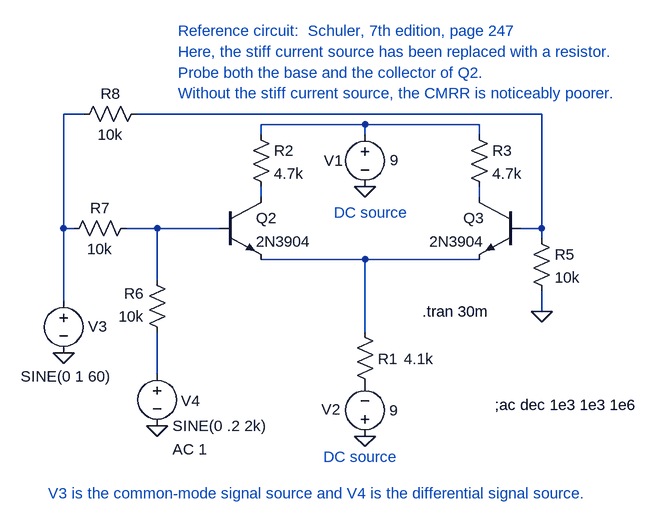
[diagram p0: schematic poordiffamp.asc]
poordiffamp.asc, the LTspice schematic file:
Version 4
SHEET 1 2236 680
WIRE -304 16 -336 16
WIRE 400 16 -224 16
WIRE 128 32 -32 32
WIRE 304 32 128 32
WIRE -32 48 -32 32
WIRE 128 48 128 32
WIRE 304 48 304 32
WIRE -32 144 -32 128
WIRE 304 144 304 128
WIRE -336 192 -336 16
WIRE -320 192 -336 192
WIRE -192 192 -240 192
WIRE -96 192 -192 192
WIRE 400 192 400 16
WIRE 400 192 368 192
WIRE 400 208 400 192
WIRE 128 240 -32 240
WIRE 304 240 128 240
WIRE -192 272 -192 192
WIRE -336 304 -336 192
WIRE 400 320 400 288
WIRE 128 352 128 240
WIRE -192 416 -192 352
FLAG 128 128 0
FLAG 128 512 0
FLAG -336 384 0
FLAG -192 496 0
FLAG 400 320 0
SYMBOL voltage 128 32 R0
WINDOW 0 -63 56 Left 0
WINDOW 3 38 55 Left 0
WINDOW 123 0 0 Left 0
WINDOW 39 24 132 Left 0
SYMATTR InstName V1
SYMATTR Value 9
SYMBOL voltage 128 528 R180
WINDOW 0 38 57 Left 0
WINDOW 3 -51 56 Left 0
WINDOW 123 0 0 Left 0
WINDOW 39 24 -12 Left 0
SYMATTR InstName V2
SYMATTR Value 9
SYMBOL res 112 336 R0
WINDOW 0 36 57 Left 0
WINDOW 3 76 57 Left 0
SYMATTR InstName R1
SYMATTR Value 4.1k
SYMBOL npn -96 144 R0
SYMATTR InstName Q2
SYMATTR Value 2N3904
SYMBOL npn 368 144 M0
SYMATTR InstName Q3
SYMATTR Value 2N3904
SYMBOL res -48 32 R0
SYMATTR InstName R2
SYMATTR Value 4.7k
SYMBOL res 288 32 R0
SYMATTR InstName R3
SYMATTR Value 4.7k
SYMBOL voltage -336 288 R0
WINDOW 0 38 55 Left 0
WINDOW 3 -66 132 Left 0
WINDOW 123 -44 165 Left 0
WINDOW 39 0 0 Left 0
SYMATTR InstName V3
SYMATTR Value SINE(0 1 60)
SYMBOL res -224 176 R90
WINDOW 0 0 56 VBottom 0
WINDOW 3 32 56 VTop 0
SYMATTR InstName R7
SYMATTR Value 10k
SYMBOL res -176 368 R180
WINDOW 0 36 76 Left 0
WINDOW 3 36 40 Left 0
SYMATTR InstName R6
SYMATTR Value 10k
SYMBOL voltage -192 400 R0
WINDOW 0 37 58 Left 0
WINDOW 123 24 132 Left 0
WINDOW 39 0 0 Left 0
SYMATTR InstName V4
SYMATTR Value2 AC 1
SYMATTR Value SINE(0 .2 2k)
SYMBOL res -208 0 R90
WINDOW 0 0 56 VBottom 0
WINDOW 3 32 56 VTop 0
SYMATTR InstName R8
SYMATTR Value 10k
SYMBOL res 384 192 R0
SYMATTR InstName R5
SYMATTR Value 10k
TEXT -360 600 Left 0 ;V3 is the common-mode signal source and V4 is the differential signal source.
TEXT -160 -112 Left 0 ;Reference circuit:  Schuler, 7th edition, page 247
TEXT 80 168 Left 0 ;DC source
TEXT 64 544 Left 0 ;DC source
TEXT -160 -80 Left 0 ;Here, the stiff current source has been replaced with a resistor.
TEXT -160 -48 Left 0 ;Probe both the base and the collector of Q2.
TEXT -160 -16 Left 0 ;Without the stiff current source, the CMRR is noticeably poorer.
TEXT 328 464 Left 0 !;ac dec 1e3 1e3 1e6
TEXT 216 320 Left 0 !.tran 30m

The netlist it stands for:
* poordiffamp.asc
V1 N003 0 9
V2 0 P001 9
R1 N007 P001 4.1k
Q2 N004 N006 N007 0 2N3904
Q3 N005 N002 N007 0 2N3904
R2 N003 N004 4.7k
R3 N003 N005 4.7k
V3 N001 0 SINE(0 1 60)
R7 N006 N001 10k
R6 N008 N006 10k
V4 N008 0 SINE(0 .2 2k) AC 1
R8 N002 N001 10k
R5 N002 0 10k
.model NPN NPN
.model PNP PNP
.lib standard.bjt
* V3 is the common-mode signal source and V4 is the differential signal source.
* Reference circuit:  Schuler, 7th edition, page 247
* DC source
* DC source
* Here, the stiff current source has been replaced with a resistor.
* Probe both the base and the collector of Q2.
* Without the stiff current source, the CMRR is noticeably poorer.
;ac dec 1e3 1e3 1e6
.tran 30m
.backanno
.end